# Altium schematic sheet WheelInputConditioning.SchDoc
size A; DocumentNumber: 12; SheetNumber: 12; SheetTotal: 12
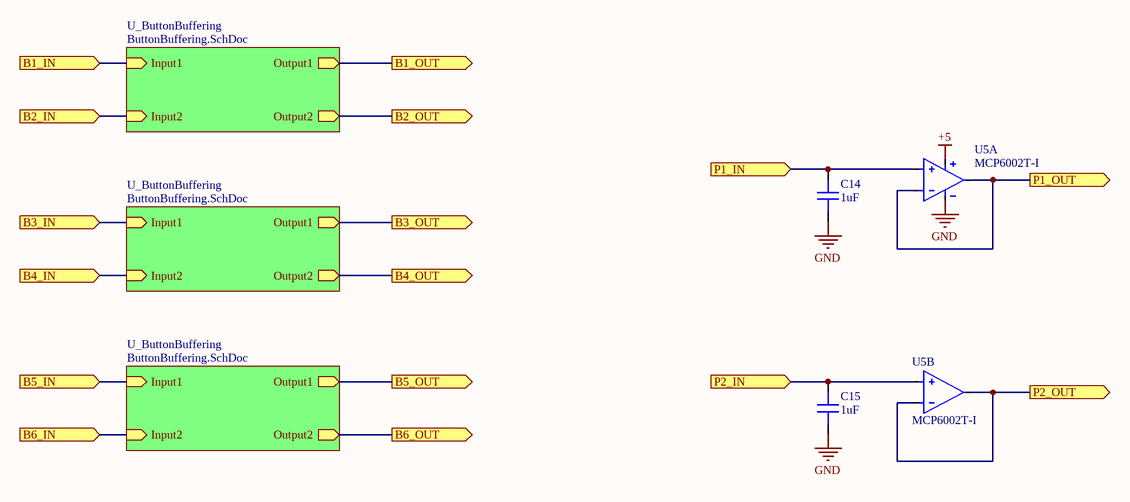
[diagram p0: WheelInputConditioning.SchDoc]

## Parts
C14  capacitance: 1uF  [0603]  (hidden comment: capacitor)
C15  capacitance: 1uF  [0603]  (hidden comment: capacitor)
U5  MCP6002T-I  [SOIC-8]  (parts A,B of 2)

## Sub-sheets
U_ButtonBuffering = ButtonBuffering.SchDoc: Input2 (in), Output1 (out), Output2 (out), Input1 (in)
U_ButtonBuffering = ButtonBuffering.SchDoc: Input2 (in), Output1 (out), Output2 (out), Input1 (in)
U_ButtonBuffering = ButtonBuffering.SchDoc: Input2 (in), Output1 (out), Output2 (out), Input1 (in)

## Ports
B1_IN (in), B1_OUT (out), B2_IN (in), B2_OUT (out), B3_IN (in), B3_OUT (out), B4_IN (in), B4_OUT (out), B5_IN (in), B5_OUT (out), B6_IN (in), B6_OUT (out), P1_IN (in), P1_OUT (out), P2_IN (in), P2_OUT (out)

## Nets
+5: U5.8(V+)
GND: C14.2 C15.2 U5.4(V-)
B1_IN: port B1_IN, sheet U_ButtonBuffering/Input1
B1_OUT: port B1_OUT, sheet U_ButtonBuffering/Output1
B2_IN: port B2_IN, sheet U_ButtonBuffering/Input2
B2_OUT: port B2_OUT, sheet U_ButtonBuffering/Output2
B3_IN: port B3_IN, sheet U_ButtonBuffering/Input1
B3_OUT: port B3_OUT, sheet U_ButtonBuffering/Output1
B4_IN: port B4_IN, sheet U_ButtonBuffering/Input2
B4_OUT: port B4_OUT, sheet U_ButtonBuffering/Output2
B5_IN: port B5_IN, sheet U_ButtonBuffering/Input1
B5_OUT: port B5_OUT, sheet U_ButtonBuffering/Output1
B6_IN: port B6_IN, sheet U_ButtonBuffering/Input2
B6_OUT: port B6_OUT, sheet U_ButtonBuffering/Output2
P1_IN: C14.1 U5.3(+IN_A) ; port P1_IN
P1_OUT: U5.1(OUT_A) U5.2(-IN_A) ; port P1_OUT
P2_IN: C15.1 U5.5(+IN_B) ; port P2_IN
P2_OUT: U5.6(-IN_B) U5.7(OUT_B) ; port P2_OUT

## Library data of the parts
C14 C15 = 1: Generic 0603 capacitor; id: 1; voltage: 50; dielectric: Ceramic; percent tolerance: 10; name: 0603 Capacitor; ESR: 1; package: 0603; quantity: 0
U5 = 2: Rail-to-Rail 2 Circuit OPAMP 8SOIC; id: 2; voltage: 6; slewrate: 0.600000023841858; gbw: 0; currentoutput: 23; voltagelow: 1.79999995231628; Name: MCP6002T-I; num_circuits: 2; voltagehigh: 6; quantity: 0; link: https://www.digikey.com/product-detail/en/microchip-technology/MCP6002T-I-SN/MCP6002T-I-SNCT-ND/4307905; createdby: Kevin